# EAGLE design Coatroller (EAGLE 7.5.0)
still needs: 2.on/off switch 4.status LED Pattern button will be moved to the sleeve.
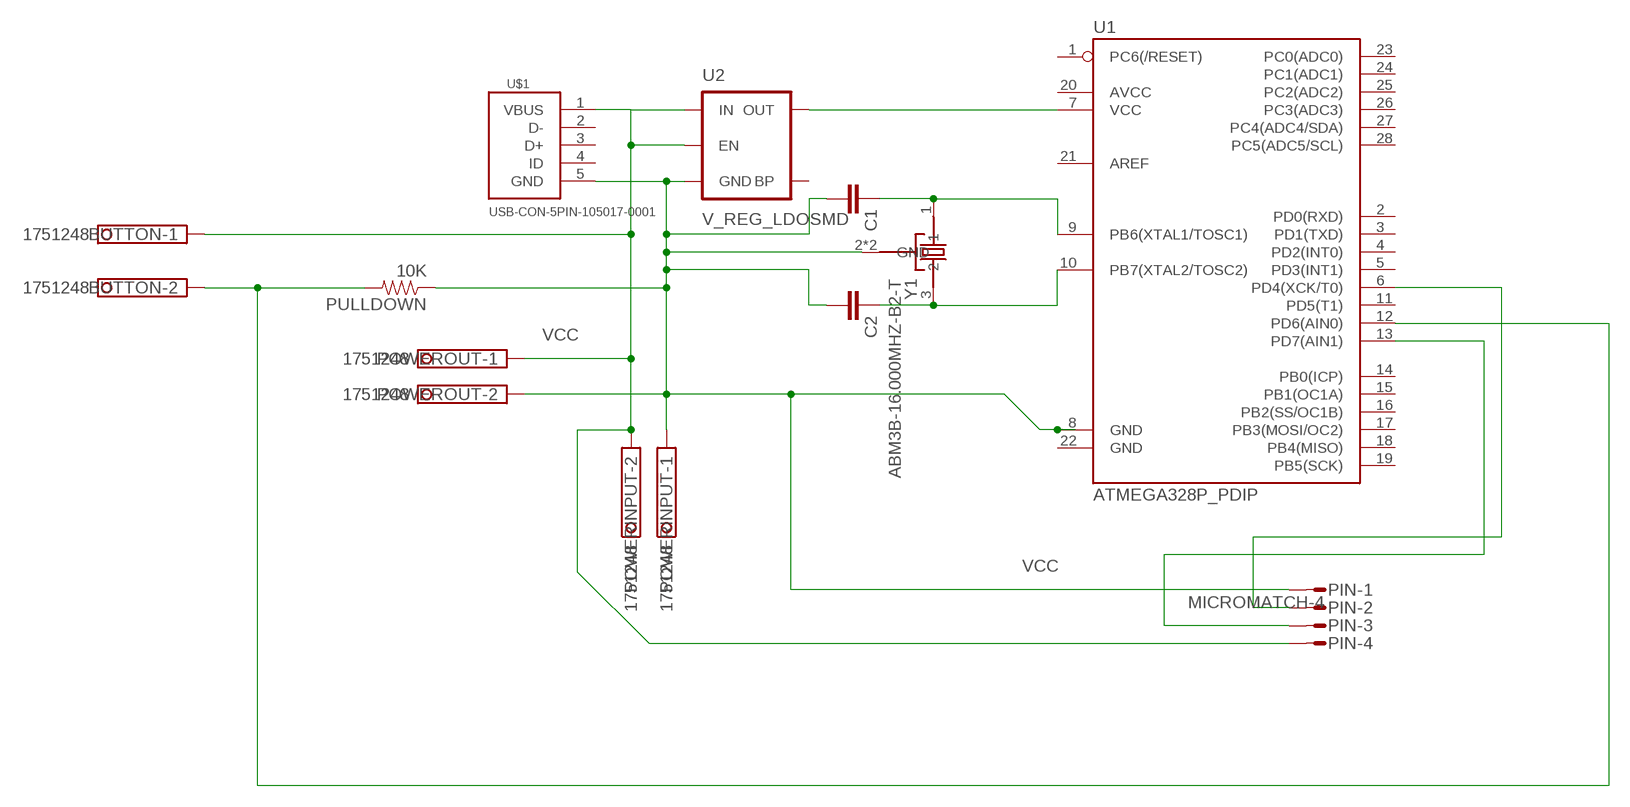
[diagram p0: schematic, sheet 1]

## Parts
BUTTON  1751248  [1751248]
C1  2.2UF50V10%(1206)  [1206-CAP]
C2  2.2UF50V10%(1206)  [1206-CAP]
PIN  MICROMATCH-4  [MICROMATCH-4]
POWERINPUT  1751248  [1751248]
POWEROUT  1751248  [1751248]
PULLDOWN  10K  10KOHM-1/10W-1%(0603)0603  [0603-RES]
U1  ATMEGA328P_PDIP  [DIL28-3]
U2  V_REG_LDOSMD  [SOT23-5]
U$1  USB-CON-5PIN-105017-0001  [USB-MICRO-MOLEX-105017-0001]
Y1  ABM3B-16.000MHZ-B2-T  [OSCSC500X320X110-4N]

## Nets
5V: U1.7(VCC) U2.5(OUT)
BUTTONPIN: BUTTON.2 PULLDOWN.2 U1.12(PD6(AIN0))
CLOCK: PIN.2 U1.6(PD4(XCK/T0))
DATA: PIN.3 U1.13(PD7(AIN1))
GROUND: C1.2 C2.2 PIN.1 POWERINPUT.1 POWEROUT.2 PULLDOWN.1 U1.8(GND) U2.2(GND) U$1.5(GND) Y1.2(GND) Y1.4(GND)
N$1: C1.1 U1.9(PB6(XTAL1/TOSC1)) Y1.1
N$2: C2.1 U1.10(PB7(XTAL2/TOSC2)) Y1.3
VCC: BUTTON.1 PIN.4 POWERINPUT.2 POWEROUT.1 U2.1(IN) U2.3(EN) U$1.1(VBUS)
Unconnected: U1.1(PC6(/RESET)) U1.2(PD0(RXD)) U1.3(PD1(TXD)) U1.4(PD2(INT0)) U1.5(PD3(INT1)) U1.11(PD5(T1)) U1.14(PB0(ICP)) U1.15(PB1(OC1A)) U1.16(PB2(SS/OC1B)) U1.17(PB3(MOSI/OC2)) U1.18(PB4(MISO)) U1.19(PB5(SCK)) U1.20(AVCC) U1.21(AREF) U1.22(GND) U1.23(PC0(ADC0)) U1.24(PC1(ADC1)) U1.25(PC2(ADC2)) U1.26(PC3(ADC3)) U1.27(PC4(ADC4/SDA)) U1.28(PC5(ADC5/SCL)) U2.4(BP) U$1.2(D-) U$1.3(D+) U$1.4(ID)

## Library data of the parts
BUTTON POWERINPUT POWEROUT = con-phoenix-350:1751248: MKDS 1/ 2-3,5 Printklemme Nennstrom: 10 A Bemessungsspannung: 160 V Raster: 3,5 mm Polzahl: 2 Montageart: Löten Anschlussart: Schraubanschluss Anschlussrichtung vom Leiter zur Platine: 0° Source: http://eshop.phoenixcontact.com .. 1751248.pdf; OC_FARNELL: unknown; OC_NEWARK: unknown
C1 C2 = SparkFun-Capacitors:2.2UF50V10%(1206): CAP-10009
PIN = con-amp-micromatch:MICROMATCH-4: MicroMaTch 4 7-215464-4 / 0-215464-4 Drawing Number C-215464 DDEController.pdf; MPN: 7-215464-4; OC_FARNELL: 3784629; OC_NEWARK: 19R8124
PULLDOWN = SparkFun-Resistors:10KOHM-1/10W-1%(0603): RES-00824; PROD_ID: RES-00824
U1 = SparkFun-DigitalIC:ATMEGA328P_PDIP: uC used in the Arduino 32kb flash, 1k EEPROM, 2k SRAM This is the through-hole version of this chip.
U2 = SparkFun-PowerIC:V_REG_LDO: Voltage Regulator LDO Standard 150mA LDO voltage regulator in SOT-23 layout. Micrel part MIC5205. BP (by-pass) pin is used to lower output noise with 470pF cap.
U$1 = GeekAmmo:USB-CON-5PIN: Molex Micro USB 105017-0001
Y1 = ABM3B-16.000MHZ-B2-T:ABM3B-16.000MHZ-B2-T: Crystal 16MHz 20ppm (Tol) 50ppm (Stability) 18pF FUND 50Ohm 4-Pin CSMD T/R; AVAILABILITY: Good; DESCRIPTION: Crystal 16MHz %3F%3F20ppm %28Tol%29 %3F%3F50ppm %28Stability%29 18pF FUND 50Ohm 4-Pin CSMD T/R; MF: Abracon; MP: ABM3B-16.000MHZ-B2-T; PACKAGE: 5.0 x 3.2mm Abracon; PRICE: 0.52 USD

## Board
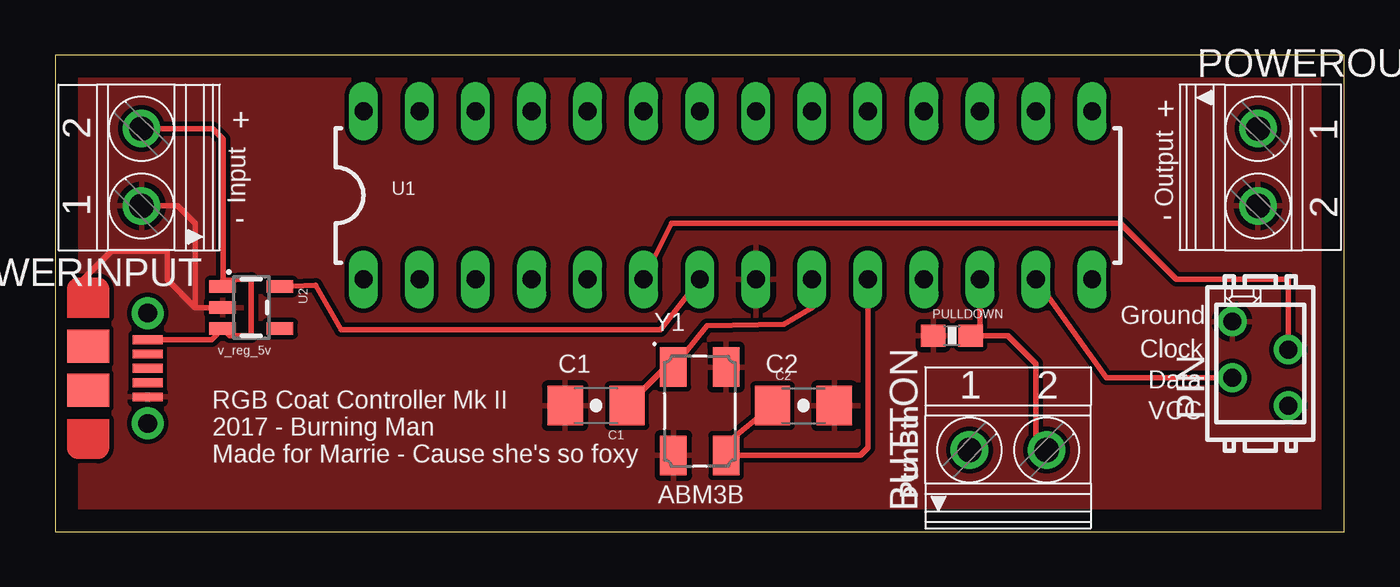
[diagram p1: board, top side]
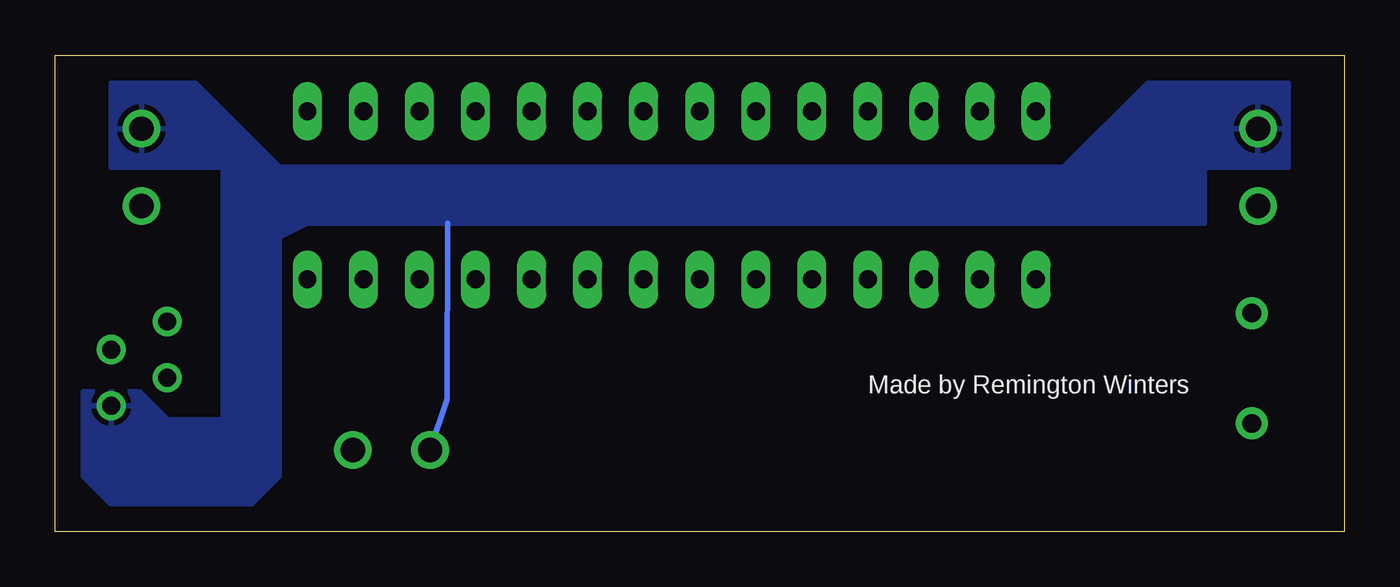
[diagram p2: board, bottom side, seen from below]

Size 58.42 x 21.59 mm. Coordinates in mm from the lower left corner, seen from the top.
Outline: 0,0 58.42,0 58.42,21.59 0,21.58 0,0
Copper layers (1*16): Top 0.035mm / dielectric 1.5mm / Bottom 0.035mm
Design rules "default": minimum track width 10mil, minimum drill 24mil, track to track 8mil, track to pad 8mil, pad to pad 8mil, via to via 8mil, smd to smd 8mil, copper to edge 40mil, drill to drill 8mil, minimum pad ring 10mil, minimum via ring 8mil, stop-mask expansion 4mil, vias tented up to drill 0mil, thermal gap 10mil

### Footprints (pad centres in the part's own frame; a part is rotated, then mirrored left to right if it is on the bottom)
1751248 = drill 1.1 pad 1.7: 1 -1.75,-0.1; 2 1.75,-0.1
1206-CAP = smd 1.6 x 1.8: 1 -1.4,0; 2 1.4,0
MICROMATCH-4 = drill 0.813: 1 1.905,1.27; 2 0.635,-1.27; 3 -0.635,1.27; 4 -1.905,-1.27
0603-RES = smd 1.1 x 1: 1 -0.85,0; 2 0.85,0
DIL28-3 = drill 0.813 long: 1 -16.51,-3.81; 2 -13.97,-3.81; 3 -11.43,-3.81; 4 -8.89,-3.81; 5 -6.35,-3.81; 6 -3.81,-3.81; 7 -1.27,-3.81; 8 1.27,-3.81; 9 3.81,-3.81; 10 6.35,-3.81; 11 8.89,-3.81; 12 11.43,-3.81; 13 13.97,-3.81; 14 16.51,-3.81; 15 16.51,3.81; 16 13.97,3.81; 17 11.43,3.81; 18 8.89,3.81; 19 6.35,3.81; 20 3.81,3.81; 21 1.27,3.81; 22 -1.27,3.81; 23 -3.81,3.81; 24 -6.35,3.81; 25 -8.89,3.81; 26 -11.43,3.81; 27 -13.97,3.81; 28 -16.51,3.81
SOT23-5 = smd 0.55 x 1.2: 1 -0.95,-1.3; 2 0,-1.3; 3 0.95,-1.3; 4 0.95,1.3; 5 -0.95,1.3
USB-MICRO-MOLEX-105017-0001 = smd 0.4 x 1.35: 1 1.2,0; 2 1.85,0; 3 2.5,0; 4 3.15,0; 5 3.8,0 | drill 0.85 pad 1.45: P$1 0,0; P$2 5,0 | smd 1.5 x 1.9: P$3 3.5,-2.7; P$4 1.5,-2.7
OSCSC500X320X110-4N = smd 1.2 x 1.8: 1 -1.2,2; 2 -1.2,-2; 3 1.2,-2; 4 1.2,2

### Placement (x,y rotation side)
BUTTON  43.18,3.81 0 top
C1  24.51,5.71 180 top
C2  33.91,5.71 0 top
PIN  54.61,7.62 90 top
POWERINPUT  3.81,16.51 90 top
POWEROUT  54.61,16.51 270 top
PULLDOWN  40.64,8.89 0 top
U1  30.48,15.24 0 top
U2  8.89,10.16 270 top
U$1  4.19,9.91 270 top
Y1  29.21,5.46 0 top

### Tracks (layer width: path | path; a pad name or v marks a point on that pad's centre or on a via)
5V
  Top 0.254: U2.5 11.81,11.18 12.95,9.14 27.43,9.14 U1.7
BUTTONPIN
  Top 0.254: U1.12 41.91,9.31 PULLDOWN.2 43.18,8.89 44.45,7.62 44.45,4.19 BUTTON.2
CLOCK
  Top 0.254: PIN.2 55.88,11.43 50.8,11.43 48.26,13.97 27.94,13.97 U1.6
DATA
  Top 0.254: PIN.3 47.62,6.99 U1.13
GROUND
  Top 0.254: 1.27,11.43 2.54,12.7 5.08,12.7 5.08,11.43 6.35,10.16 | 6.35,10.16 U2.2 | POWERINPUT.1 5.56,14.76 6.35,13.97 6.35,10.16
  pour Top: 0,21.59 0,0 58.42,0 58.42,21.59
N$1
  Top 0.254: 34.36,11.36 U1.9 34.29,10.16 33.02,9.4 29.53,9.33 Y1.1 27.66,7.46 C1.1
N$2
  Top 0.254: C2.1 30.41,4 Y1.3 36.48,3.46 36.83,3.81 U1.10
VCC
  Top 0.254: POWERINPUT.2 7.14,18.26 7.62,17.78 7.62,11.14 U2.1 7.59,11.4 8.89,11.43 8.89,8.89 7.91,8.89 U2.3 | 7.62,9.18 U2.3 | U$1.1 7.09,8.71 U2.3
  Bottom 0.254: BUTTON.1 40.67,6 40.64,13.97
  pour Bottom: 2.54,20.32 8.89,20.32 12.7,16.51 48.26,16.51 52.07,20.32 55.88,20.32 55.88,16.51 50.8,16.51 50.8,11.43 49.53,12.7 46.99,13.97 6.35,13.97 6.35,16.51 2.54,16.51
  pour Bottom: 48.26,13.97 48.26,2.54 49.53,1.27 55.88,1.27 57.15,2.54 57.15,6.35 54.61,6.35 53.34,5.08 50.8,5.08 50.8,12.7

### Text on the board
tPlace: + | + | Input | Output | - | - | Ground | v_reg_5v | C1 | C2 | Clock | Data | VCC | RGB Coat Controller Mk II / 2017 - Burning Man / Made for Marrie - Cause she's so foxy | PtrnBtn | ABM3B
bPlace: Made by Remington Winters